# EAGLE schematic mie_pr_o_eagle (EAGLE 6.5.0)
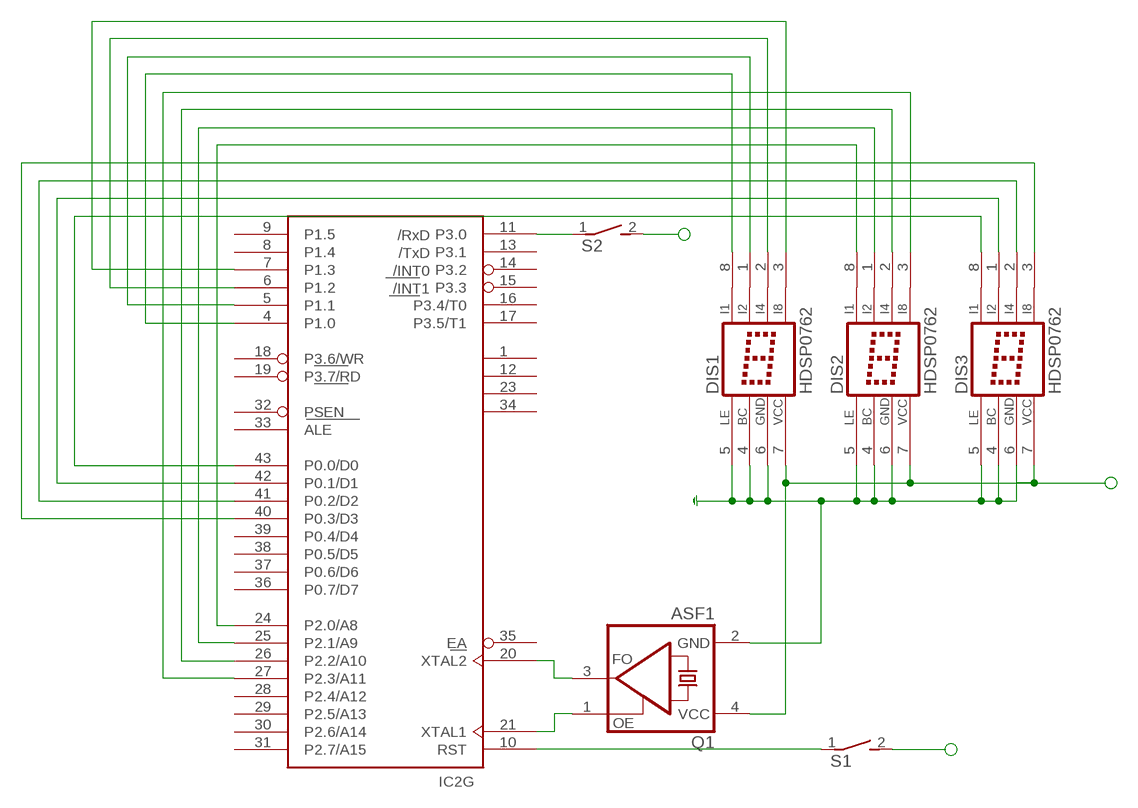
[diagram p0: schematic, sheet 1]

## Parts
DIS1  HDSP0762  [HD-0762]
DIS2  HDSP0762  [HD-0762]
DIS3  HDSP0762  [HD-0762]
IC2  80C576SMD  [PLCC44]
Q1  ASF1  [ASF]
S1  DS01E  [DS-01]
S2  DS01E  [DS-01]

## Nets
N$1: IC2.11(G:P3.0) S2.1
N$2: DIS3.8(I1) IC2.43(G:P0.0/D0)
N$3: DIS3.1(I2)
N$4: DIS1.4(BC) DIS1.5(LE) DIS1.6(GND) DIS2.4(BC) DIS2.5(LE) DIS2.6(GND) DIS3.4(BC) DIS3.5(LE) DIS3.6(GND) Q1.2(GND)
N$5: DIS3.2(I4) IC2.41(G:P0.2/D2)
N$6: DIS3.3(I8) IC2.40(G:P0.3/D3)
N$7: DIS2.8(I1) IC2.24(G:P2.0/A8)
N$8: DIS2.1(I2) IC2.25(G:P2.1/A9)
N$9: DIS2.2(I4) IC2.26(G:P2.2/A10)
N$10: DIS2.3(I8) IC2.27(G:P2.3/A11)
N$11: DIS1.8(I1) IC2.4(G:P1.0)
N$12: DIS1.1(I2) IC2.5(G:P1.1)
N$13: DIS1.2(I4) IC2.6(G:P1.2)
N$14: DIS1.3(I8) IC2.7(G:P1.3)
N$15: DIS1.7(VCC) DIS2.7(VCC) DIS3.7(VCC) Q1.4(VCC)
N$16: S2.2
N$19: IC2.20(G:XTAL2) Q1.3(FO)
N$20: IC2.21(G:XTAL1) Q1.1(OE)
N$21: IC2.10(G:RST) S1.1
N$22: S1.2
Unconnected: IC2.1(G:NC) IC2.8(G:P1.4) IC2.9(G:P1.5) IC2.12(G:NC) IC2.13(G:P3.1) IC2.14(G:P3.2) IC2.15(G:P3.3) IC2.16(G:P3.4/T0) IC2.17(G:P3.5/T1) IC2.18(G:P3.6/WR) IC2.19(G:P3.7/RD) IC2.23(G:NC) IC2.28(G:P2.4/A12) IC2.29(G:P2.5/A13) IC2.30(G:P2.6/A14) IC2.31(G:P2.7/A15) IC2.32(G:PSEN) IC2.33(G:ALE) IC2.34(G:NC) IC2.35(G:EA) IC2.36(G:P0.7/D7) IC2.37(G:P0.6/D6) IC2.38(G:P0.5/D5) IC2.39(G:P0.4/D4) IC2.42(G:P0.1/D1)

## Power pins joined to a net without a drawn wire
AGND: IC2.3(A:AGND)
AVCC: IC2.2(A:AVCC)
GND: IC2.22(P:GND)
VCC: IC2.44(P:VCC)

## Library data of the parts
DIS1-DIS3 = display-hp:HDSP0762: LED DISPLAY 1-character dot matrix without decimal point; MF: AGILENT TECHNOLOGIES; MPN: HDSP-0762; OC_FARNELL: 9869883; OC_NEWARK: 39K9789
IC2 = micro-philips:80C576: 8051 -compatible 8-bit Microcontroller; OC_FARNELL: unknown; OC_NEWARK: unknown
Q1 = crystal:ASF*: CRYSTAL CLOCK OSCILLATORS 5.0 Vdc or 3.3 Vdc - LOW PROFILE ULTRA MINIATURE CERAMIC SURFACE MOUNT Source: http://www.abracon.com/Oscillators/asf1-L-L1.pdf; OC_FARNELL: unknown; OC_NEWARK: unknown
S1 S2 = switch-dil:DS01E: DIL/CODE SWITCH; OC_FARNELL: unknown; OC_NEWARK: unknown